# EAGLE design simple_pa_ctl (EAGLE 9.1.0)
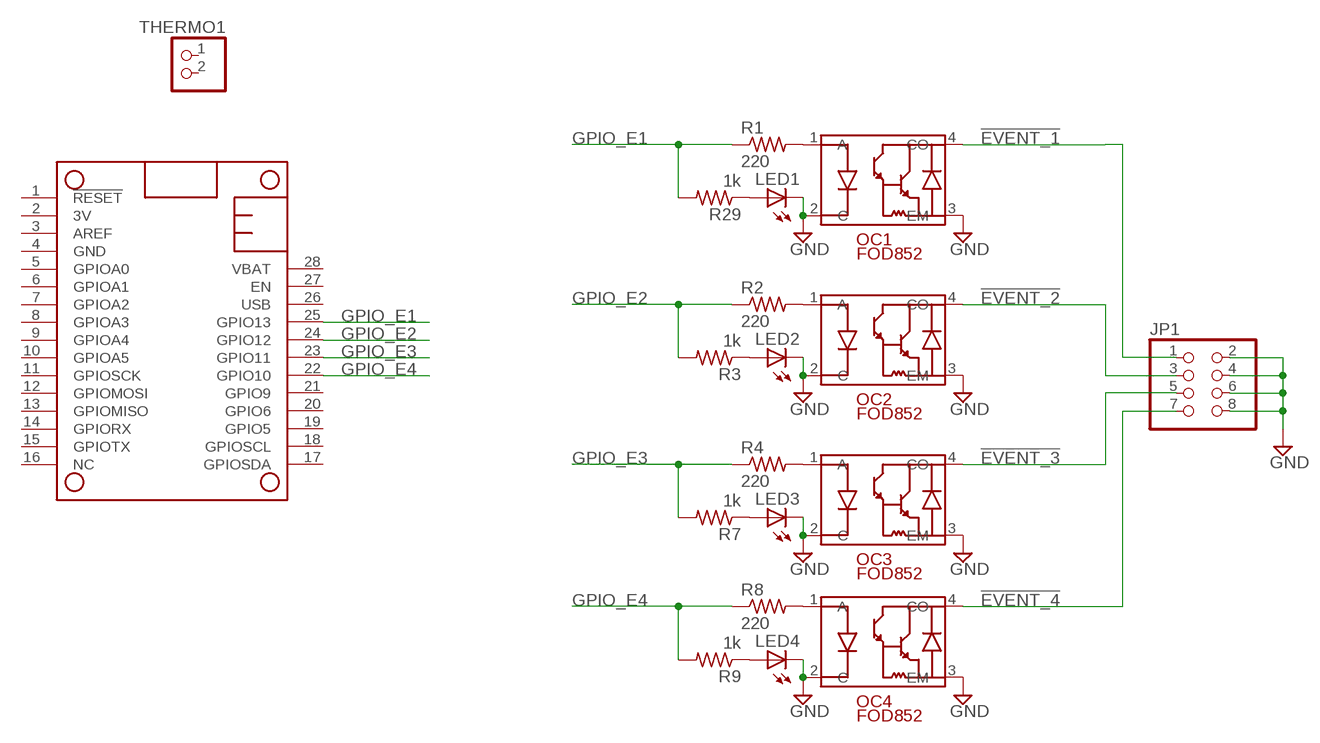
[diagram p0: schematic, sheet 1]

## Parts
JP1  PINHD-2X4  [2X04]
LED1  LEDCHIPLED_0805  [CHIPLED_0805]
LED2  LEDCHIPLED_0805  [CHIPLED_0805]
LED3  LEDCHIPLED_0805  [CHIPLED_0805]
LED4  LEDCHIPLED_0805  [CHIPLED_0805]
MS1  FEATHERWING  [FEATHERWING]
OC1  FOD852  [SMD4-7]
OC2  FOD852  [SMD4-7]
OC3  FOD852  [SMD4-7]
OC4  FOD852  [SMD4-7]
R1  220  R-US_R0805  [R0805]
R2  220  R-US_R0805  [R0805]
R3  1k  R-US_R0805  [R0805]
R4  220  R-US_R0805  [R0805]
R7  1k  R-US_R0805  [R0805]
R8  220  R-US_R0805  [R0805]
R9  1k  R-US_R0805  [R0805]
R29  1k  R-US_R0805  [R0805]
THERMO1  PINHD-1X2  [1X02]

## Nets
!EVENT_1: JP1.1 OC1.4(CO)
!EVENT_2: JP1.3 OC2.4(CO)
!EVENT_3: JP1.5 OC3.4(CO)
!EVENT_4: JP1.7 OC4.4(CO)
GND: JP1.2 JP1.4 JP1.6 JP1.8 LED1.C LED2.C LED3.C LED4.C OC1.2(C) OC1.3(EM) OC2.2(C) OC2.3(EM) OC3.2(C) OC3.3(EM) OC4.2(C) OC4.3(EM)
GPIO_E1: MS1.25(GPIO13) R1.1 R29.2
GPIO_E2: MS1.24(GPIO12) R2.1 R3.2
GPIO_E3: MS1.23(GPIO11) R4.1 R7.2
GPIO_E4: MS1.22(GPIO10) R8.1 R9.2
N$1: OC1.1(A) R1.2
N$2: LED1.A R29.1
N$3: OC2.1(A) R2.2
N$4: LED2.A R3.1
N$5: OC3.1(A) R4.2
N$6: LED3.A R7.1
N$7: OC4.1(A) R8.2
N$8: LED4.A R9.1
Unconnected: MS1.1(!RESET) MS1.2(3V) MS1.3(AREF) MS1.5(GPIOA0) MS1.6(GPIOA1) MS1.7(GPIOA2) MS1.8(GPIOA3) MS1.9(GPIOA4) MS1.10(GPIOA5) MS1.11(GPIOSCK) MS1.12(GPIOMOSI) MS1.13(GPIOMISO) MS1.14(GPIORX) MS1.15(GPIOTX) MS1.16(NC) MS1.17(GPIOSDA) MS1.18(GPIOSCL) MS1.19(GPIO5) MS1.20(GPIO6) MS1.21(GPIO9) MS1.26(USB) MS1.27(EN) MS1.28(VBAT) THERMO1.1 THERMO1.2

## Power pins joined to a net without a drawn wire
GND: MS1.4(GND)

## Library data of the parts
JP1 = pinhead:PINHD-2X4: PIN HEADER
LED1-LED4 = adafruit:LED: LED OSRAM: - CHIPLED LG R971, LG N971, LY N971, LG Q971, LY Q971, LO R971, LY R971 LH N974, LH R974 LS Q976, LO Q976, LY Q976 LO Q996 - Hyper CHIPLED LW Q18S LB Q993, LB Q99A, LB R99A - SideLED LS A670, LO A670, LY A670, LG A670, LP A670 LB A673, LV A673, LT A673, LW A673 LH A674 LY A675 LS A676, LA A676, LO A676, LY A676, LW A676 LS A679, LY A679, LG A679 - Hyper Micro SIDELED® LS Y876, LA Y876, LO Y876, LY Y876 LT Y87S - SmartLED LW L88C, LW L88S LB L89C, LB L89S, LG L890 LS L89K, LO L89K, LY L89K LS L896, LA L896, LO L896, LY L896 - TOPLED LS T670, LO T670, LY T670, LG T670, LP T670 LSG T670, LSP T670, LSY T670, LOP T670, LYG T670 LG T671, LOG T671, LSG T671 LB T673, LV T673, LT T673, LW T673 LH T674 LS T676, LA T676, LO T676, LY T676, LB T676, LH T676, LSB T676, LW T676 LB T67C, LV T67C, LT T67C, LS T67K, LO T67K, LY T67K, LW E67C LS E67B, LA E67B, LO E67B, LY E67B, LB E67C, LV E67C, LT E67C LW T67C LS T679, LY T679, LG T679 LS T770, LO T770, LY T770, LG T770, LP T770 LB T773, LV T773, LT T773, LW T773 LH T774 LS E675, LA E675, LY E675, LS T675 LS T776, LA T776, LO T776, LY T776, LB T776 LHGB T686 LT T68C, LB T68C - Hyper Mini TOPLED® LB M676 - Mini TOPLED Santana® LG M470 LS M47K, LO M47K, LY M47K Source: http://www.osram.convergy.de/
MS1 = adafruit:FEATHERWING
OC1-OC4 = vtgs:FOD852
R1-R4 R7-R9 R29 = rcl:R-US_: RESISTOR, American symbol; SPICEPREFIX: R
THERMO1 = pinhead:PINHD-1X2: PIN HEADER

## Board
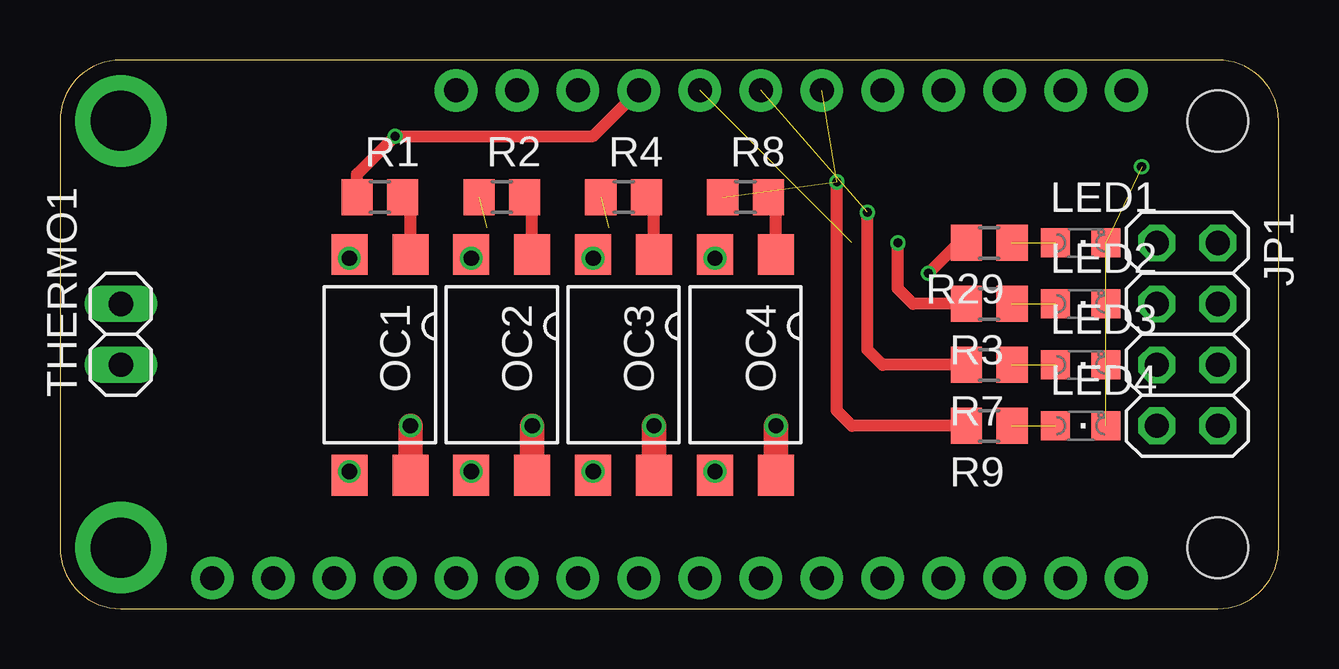
[diagram p1: board, top side]
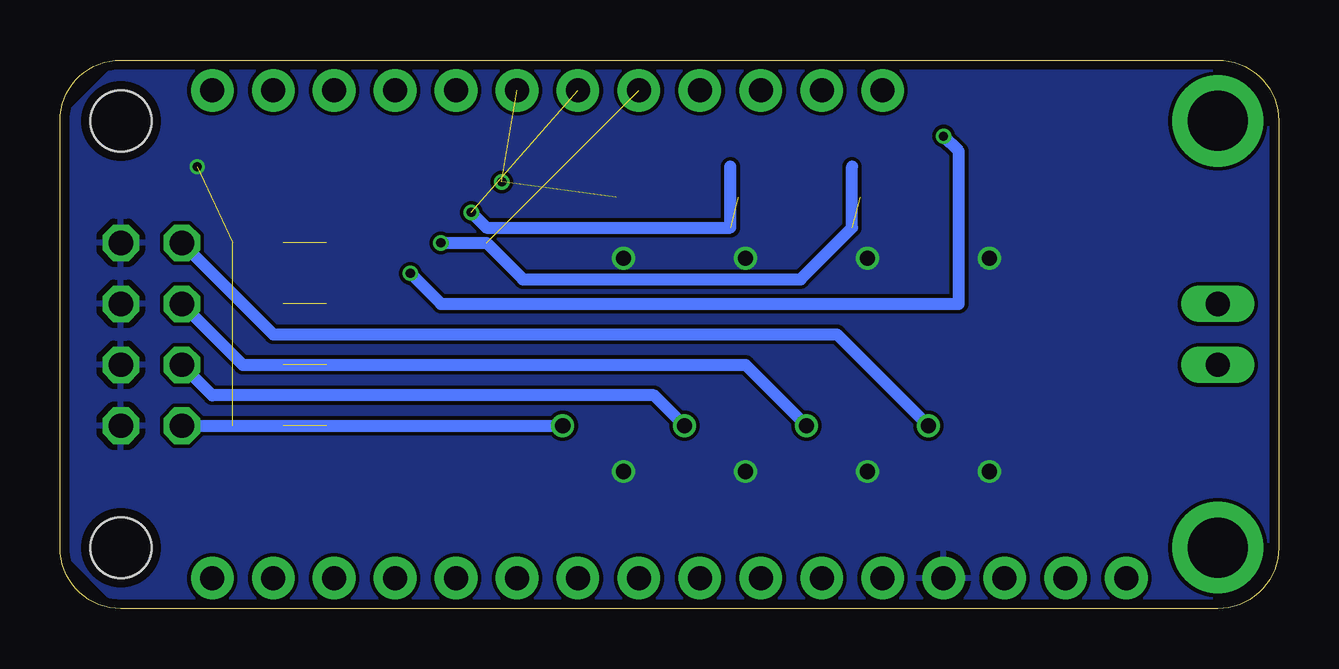
[diagram p2: board, bottom side, seen from below]

Size 50.8 x 22.86 mm. Coordinates in mm from the lower left corner, seen from the top.
Copper layers (1*16): Top 0.035559375mm / dielectric 1.6mm / Bottom 0.035559375mm
Design rules "oshpark-2layer": minimum track width 6mil, minimum drill 10mil, track to track 6mil, track to pad 6mil, pad to pad 6mil, via to via 6mil, smd to smd 6mil, copper to edge 15mil, drill to drill 6mil, minimum pad ring 5mil, minimum via ring 5mil, stop-mask expansion 2.5mil, vias tented up to drill 0mil, thermal gap 10mil

### Footprints (pad centres in the part's own frame; a part is rotated, then mirrored left to right if it is on the bottom)
2X04 = drill 1.016 octagon: 1 -3.81,-1.27; 2 -3.81,1.27; 3 -1.27,-1.27; 4 -1.27,1.27; 5 1.27,-1.27; 6 1.27,1.27; 7 3.81,-1.27; 8 3.81,1.27
CHIPLED_0805 = smd 1.2 x 1.2: A 0,-1.05; C 0,1.05
FEATHERWING = drill 1 pad 1.778: 1 6.35,1.27; 2 8.89,1.27; 3 11.43,1.27; 4 13.97,1.27; 5 16.51,1.27; 6 19.05,1.27; 7 21.59,1.27; 8 24.13,1.27; 9 26.67,1.27; 10 29.21,1.27; 11 31.75,1.27; 12 34.29,1.27; 13 36.83,1.27; 14 39.37,1.27; 15 41.91,1.27; 16 44.45,1.27; 17 44.45,21.59; 18 41.91,21.59; 19 39.37,21.59; 20 36.83,21.59; 21 34.29,21.59; 22 31.75,21.59; 23 29.21,21.59; 24 26.67,21.59; 25 24.13,21.59; 26 21.59,21.59; 27 19.05,21.59; 28 16.51,21.59 | drill 2.5 pad 3.81: P$1 2.54,20.32; P$2 2.54,2.54 | hole 2.54: 48.26,20.32; 48.26,2.54
SMD4-7 = smd 1.7 x 1.5: 1 -4.6,1.27; 2 -4.6,-1.27; 3 4.6,-1.27; 4 4.6,1.27
R0805 = smd 1.3 x 1.5: 1 -0.95,0; 2 0.95,0
1X02 = drill 1.016 long: 1 -1.27,0; 2 1.27,0

### Placement (x,y rotation side)
JP1  46.99,11.43 270 top
LED1  42.55,15.24 270 top
LED2  42.55,12.7 270 top
LED3  42.55,10.16 270 top
LED4  42.55,7.62 270 top
MS1  0,0 0 top
OC1  13.34,10.16 270 top
OC2  18.41,10.16 270 top
OC3  23.5,10.16 270 top
OC4  28.57,10.16 270 top
R1  13.34,17.14 0 top
R2  18.41,17.14 0 top
R3  38.73,12.7 180 top
R4  23.5,17.14 0 top
R7  38.73,10.16 180 top
R8  28.57,17.14 0 top
R9  38.73,7.62 180 top
R29  38.73,15.24 180 top
THERMO1  2.54,11.43 90 top

### Tracks (layer width: path | path; a pad name or v marks a point on that pad's centre or on a via)
!EVENT_1  (via drill 0.64)
  Top 1.016: OC1.4 v14.61,7.62
  Bottom 0.508: v14.61,7.62 18.41,11.43 41.91,11.43 JP1.1
!EVENT_2  (via drill 0.64)
  Top 1.016: OC2.4 v19.68,7.62
  Bottom 0.508: JP1.3 43.18,10.16 22.23,10.16 v19.68,7.62
!EVENT_3  (via drill 0.64)
  Top 1.016: OC3.4 v24.77,7.62
  Bottom 0.508: v24.77,7.62 26.04,8.89 44.45,8.89 JP1.5
!EVENT_4  (via drill 0.64)
  Top 1.016: OC4.4 v29.84,7.62
  Bottom 0.508: JP1.7 v29.84,7.62
GND  (via drill 0.38, 0.64)  (4 unrouted)
  Top 1.016: OC1.2 v12.06,14.61 | OC1.3 v12.06,5.71 | v17.14,14.61 OC2.2 | OC3.2 v22.23,14.61 | OC4.2 v27.3,14.61 | OC4.3 v27.3,5.71 | OC3.3 v22.23,5.71 | OC2.3 v17.14,5.71
  other vias: 45.09,18.41
  pour Bottom: 0,2.54 0,20.32 2.54,22.86 48.26,22.86 50.8,20.32 50.8,2.54 48.26,0 2.54,0
GPIO_E1  (via drill 0.38)
  Top 0.508: R1.1 12.38,18.1 v13.97,19.68 22.23,19.68 MS1.25 | R29.2 37.47,15.24 v36.2,13.97
  Bottom 0.508: v36.2,13.97 34.92,12.7 13.34,12.7 13.34,19.05 v13.97,19.68
GPIO_E2  (via drill 0.38)  (2 unrouted)
  Top 0.508: R3.2 35.56,12.7 34.92,13.34 v34.92,15.24
  Bottom 0.508: v34.92,15.24 33.02,15.24 31.5,13.72 19.93,13.72 17.78,15.88 17.78,18.41
GPIO_E3  (via drill 0.38)  (2 unrouted)
  Top 0.508: R7.2 34.29,10.16 33.66,10.79 v33.66,16.51
  Bottom 0.508: 22.86,18.41 22.86,15.88 33.02,15.88 v33.66,16.51
GPIO_E4  (via drill 0.38)  (2 unrouted)
  Top 0.508: R9.2 33.02,7.62 32.38,8.26 v32.38,17.78
N$1
  Top 0.508: OC1.1 14.61,16.82 R1.2
N$2  (1 unrouted)
N$3
  Top 0.508: OC2.1 19.68,16.82 R2.2
N$4  (1 unrouted)
N$5
  Top 0.508: OC3.1 24.77,16.82 R4.2
N$6  (1 unrouted)
N$7
  Top 0.508: OC4.1 29.84,16.82 R8.2
N$8  (1 unrouted)